# EAGLE schematic iomodul2 (EAGLE 6.6.0)
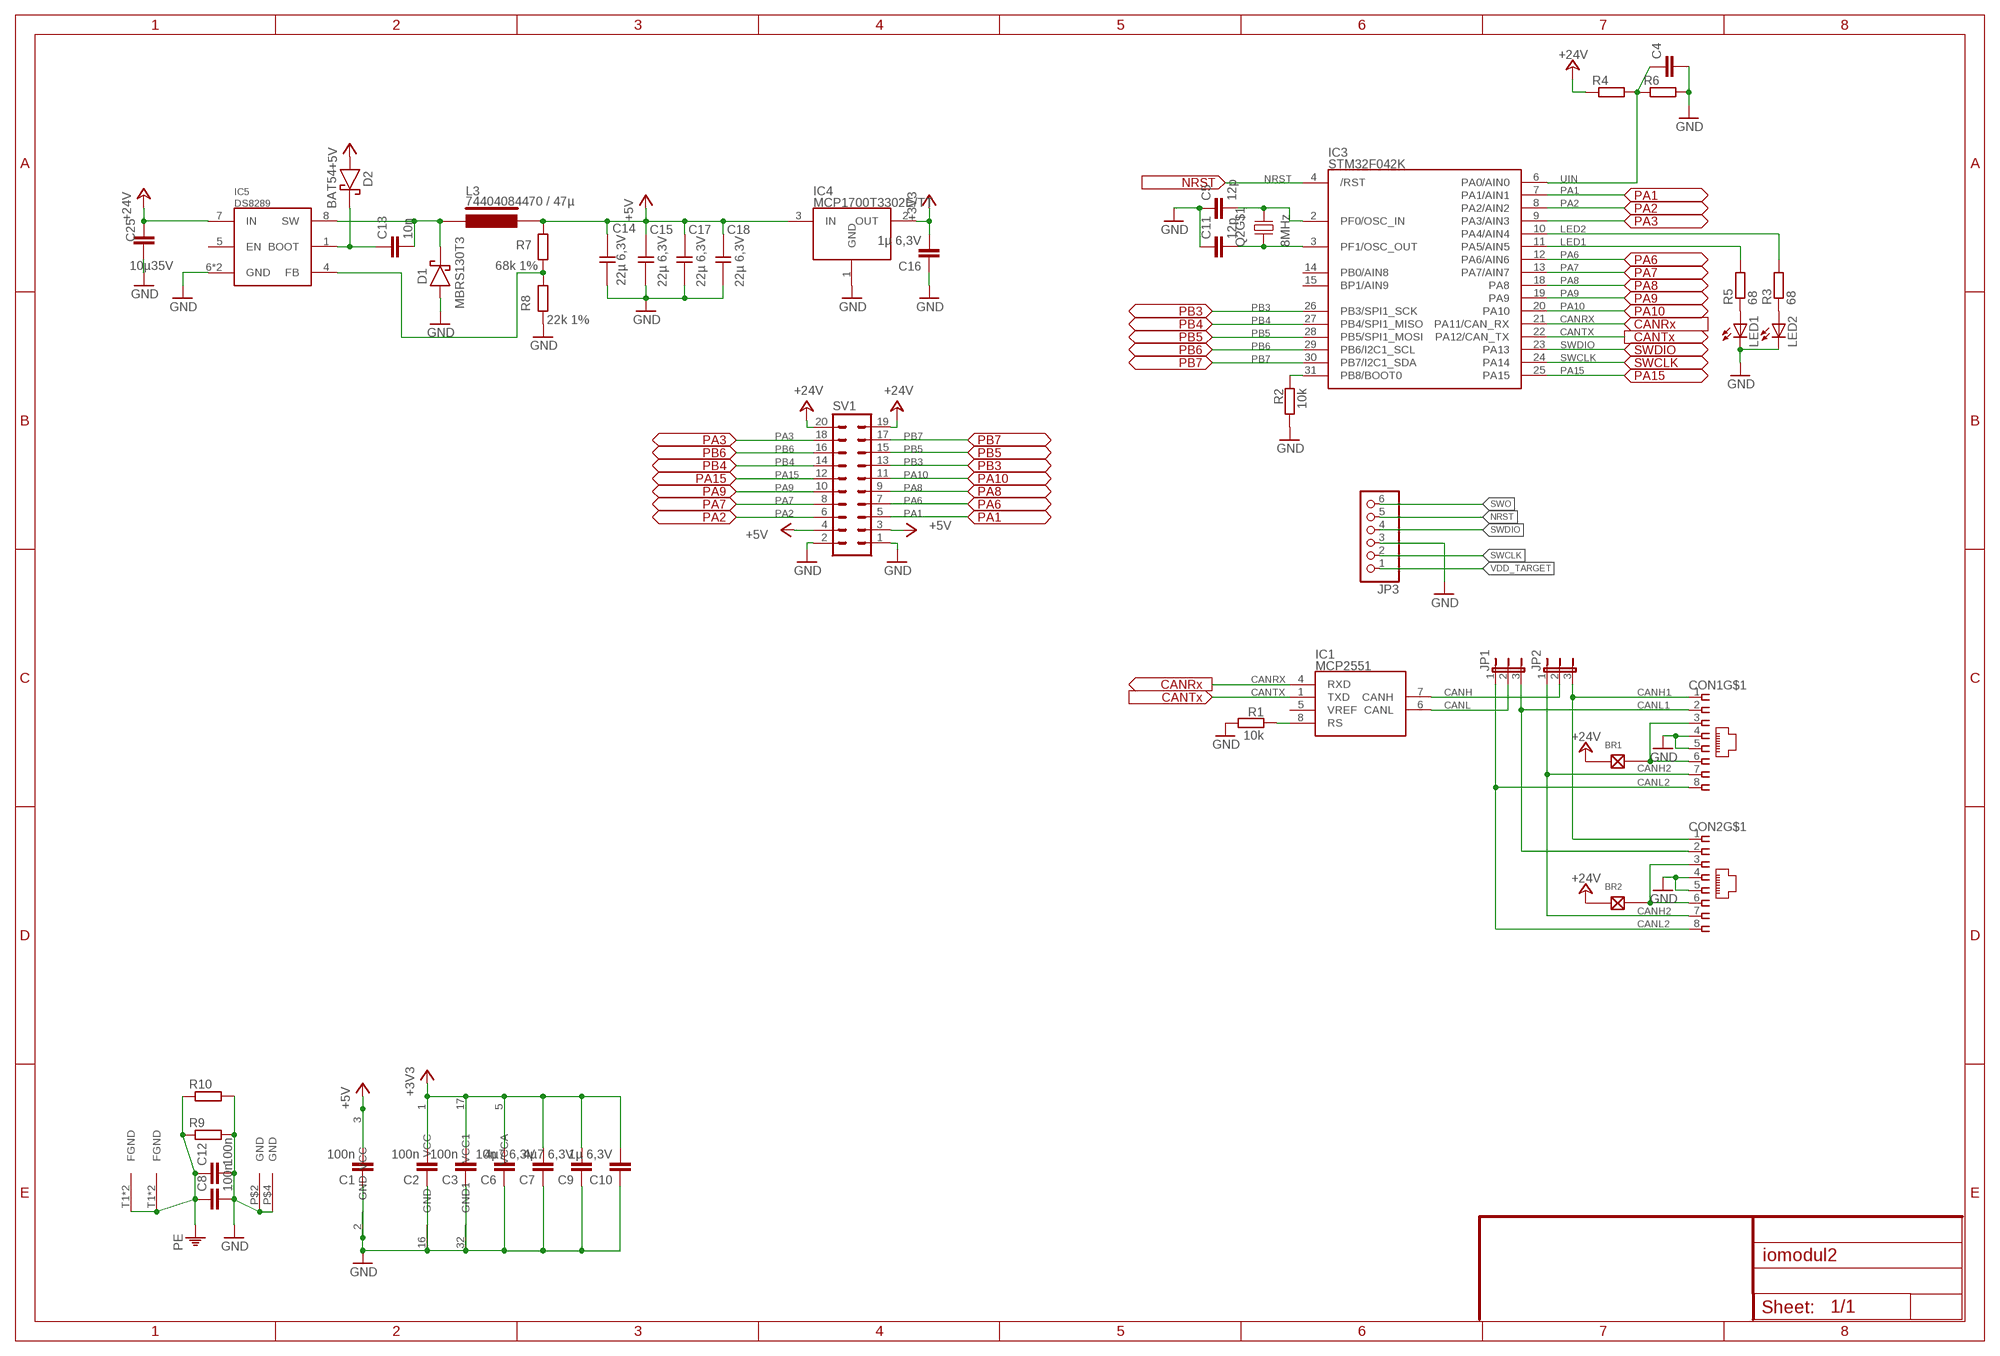
[diagram p0: schematic, sheet 1]

## Parts
BR1  LÖTBRÜCKE-S  [LÖTBRÜCKE]
BR2  LÖTBRÜCKE-S  [LÖTBRÜCKE]
C1  100n  C-EUC1206  [C1206]
C2  100n  C-EUC1206  [C1206]
C3  100n  C-EUC1206  [C1206]
C4  C-EUC1206  [C1206]
C5  12p  C-EUC1206  [C1206]
C6  10n  C-EUC1206  [C1206]
C7  4µ7 6,3V  C-EUC1206  [C1206]
C8  100n  C-EUC1206  [C1206]
C9  4µ7 6,3V  C-EUC1206  [C1206]
C10  1µ 6,3V  C-EUC1206  [C1206]
C11  12p  C-EUC1206  [C1206]
C12  100n  C-EUC1206  [C1206]
C13  10n  C-EUC1206  [C1206]
C14  22µ 6,3V  CAP1210  [1210]
C15  22µ 6,3V  CAP1210  [1210]
C16  1µ 6,3V  C-EUC1206  [C1206]
C17  22µ 6,3V  CAP1210  [1210]
C18  22µ 6,3V  CAP1210  [1210]
C25  10µ35V  C-EUC1206  [C1206]
CON1  MEBP_8-8G  [MEBP]
CON2  MEBP_8-8G  [MEBP]
D1  MBRS130T3  [SMB]
D2  BAT54  [SOT23/32]
IC1  MCP2551  [SO-8]
IC3  STM32F042K  STM32F042  [LQFP32]
IC4  MCP1700T3302E/TT  MCP1700  [SOT23]
IC5  DS8289  [SO8-POWERPAD]
JP1  JP2E  [JP2]
JP2  JP2E  [JP2]
JP3  PINHD-1X6  [1X06]
L3  74404084470 / 47µ  WE-LQS  [WE-LQS]
LED1  LEDCHIPLED_0603  [CHIPLED_0603]
LED2  LEDCHIPLED_0603  [CHIPLED_0603]
Q2  8MHz  MT-CRYSTAL  [MT-CRYSTAL]
R1  10k  R-EU_R1206  [R1206]
R2  10k  R-EU_R1206  [R1206]
R3  68  R-EU_R1206  [R1206]
R4  R-EU_R1206  [R1206]
R5  68  R-EU_R1206  [R1206]
R6  R-EU_R1206  [R1206]
R7  68k 1%  R-EU_R1206  [R1206]
R8  22k 1%  R-EU_R1206  [R1206]
R9  R-EU_R1206  [R1206]
R10  R-EU_R1206  [R1206]
SV1  MA10-2  [MA10-2]

## Nets
+3V3: C2.2 C3.2 C6.2 C7.2 C9.2 C10.2 C16.2 IC3.1(VCC) IC3.5(VCCA) IC3.17(VCC1) IC4.2(OUT)
+5V: C1.2 C14.2 C15.2 C17.2 C18.2 D2.1(A) IC1.3(VCC) IC4.3(IN) L3.P$2 R7.2 SV1.3 SV1.4
+24V: BR1.1 BR2.1 C25.2 IC5.7(IN) R4.1 SV1.19 SV1.20
CANH: IC1.7(CANH) JP2.2
CANH1: CON1.1 CON2.1 JP2.3
CANH2: CON1.7 CON2.7 JP2.1
CANL: IC1.6(CANL) JP1.2
CANL1: CON1.2 CON2.2 JP1.3
CANL2: CON1.8 CON2.8 JP1.1
CANRX: IC1.4(RXD) IC3.21(PA11/CAN_RX)
CANTX: IC1.1(TXD) IC3.22(PA12/CAN_TX)
GND: C1.1 C2.1 C3.1 C4.2 C5.1 C6.1 C7.1 C8.2 C9.1 C10.1 C11.1 C12.2 C14.1 C15.1 C16.1 C17.1 C18.1 C25.1 CON1.4 CON1.5 CON2.4 CON2.5 D1.A IC1.2(GND) IC3.16(GND) IC3.32(GND1) IC4.1(GND) IC5.6(GND) IC5.TP(GND) JP3.3 LED1.C LED2.C Q2.P$2(GND) Q2.P$4(GND) R1.2 R2.2 R6.2 R8.1 R9.2 R10.2 SV1.1 SV1.2
LED1: IC3.11(PA5/AIN5) R5.2
LED2: IC3.10(PA4/AIN4) R3.2
N$1: IC1.8(RS) R1.1
N$2: BR1.2 CON1.3 CON1.6
N$3: LED2.A R3.1
N$4: C11.2 IC3.3(PF1/OSC_OUT) Q2.P$1
N$5: C5.2 IC3.2(PF0/OSC_IN) Q2.P$3
N$6: BR2.2 CON2.3 CON2.6
N$7: LED1.A R5.1
N$12: C13.1 D2.3(K) IC5.1(BOOT)
N$13: C13.2 D1.K IC5.8(SW) L3.P$1
N$15: IC3.31(PB8/BOOT0) R2.1
N$18: IC5.4(FB) R7.1 R8.2
NRST: IC3.4(/RST) JP3.5
PA1: IC3.7(PA1/AIN1) SV1.5
PA2: IC3.8(PA2/AIN2) SV1.6
PA3: IC3.9(PA3/AIN3) SV1.18
PA6: IC3.12(PA6/AIN6) SV1.7
PA7: IC3.13(PA7/AIN7) SV1.8
PA8: IC3.18(PA8) SV1.9
PA9: IC3.19(PA9) SV1.10
PA10: IC3.20(PA10) SV1.11
PA15: IC3.25(PA15) SV1.12
PB3: IC3.26(PB3/SPI1_SCK) SV1.13
PB4: IC3.27(PB4/SPI1_MISO) SV1.14
PB5: IC3.28(PB5/SPI1_MOSI) SV1.15
PB6: IC3.29(PB6/I2C1_SCL) SV1.16
PB7: IC3.30(PB7/I2C1_SDA) SV1.17
PE: C8.1 C12.1 CON1.T1(FGND) CON1.T2(FGND) CON2.T1(FGND) CON2.T2(FGND) R9.1 R10.1
SWCLK: IC3.24(PA14) JP3.2
SWDIO: IC3.23(PA13) JP3.4
SWO: JP3.6
UIN: C4.1 IC3.6(PA0/AIN0) R4.2 R6.1
VDD_TARGET: JP3.1
Unconnected: IC1.5(VREF) IC3.14(PB0/AIN8) IC3.15(BP1/AIN9) IC5.5(EN)

## Library data of the parts
BR1 BR2 = myspecial:LÖTBRÜCKE
C1-C13 C16 C25 = schlager_passiv:C-EU: CAPACITOR, European symbol
C14 C15 C17 C18 = MYPASS:CAP1210
CON1 CON2 = myconn:MEBP_8-8G: Reichelt RJ45 geschirmt MEBP 8-8G
D1 = MYDISCR:MBRS130T3
D2 = MYDISCR:BAT54
IC1 = MYMCHIP:MCP2551: CAN Transceiver
IC3 = MYSGS:STM32F042
IC4 = MYMCHIP:MCP1700: LDO 250mA
IC5 = MYRichtek:DS8289
JP1 JP2 = jumper:JP2E: JUMPER
JP3 = pinhead:PINHD-1X6: PIN HEADER
L3 = myinductiv:WE-LQS
LED1 LED2 = led:LED: LED OSRAM: - CHIPLED LG R971, LG N971, LY N971, LG Q971, LY Q971, LO R971, LY R971 LH N974, LH R974 LS Q976, LO Q976, LY Q976 LO Q996 - Hyper CHIPLED LW Q18S LB Q993, LB Q99A, LB R99A - SideLED LS A670, LO A670, LY A670, LG A670, LP A670 LB A673, LV A673, LT A673, LW A673 LH A674 LY A675 LS A676, LA A676, LO A676, LY A676, LW A676 LS A679, LY A679, LG A679 - Hyper Micro SIDELED® LS Y876, LA Y876, LO Y876, LY Y876 LT Y87S - SmartLED LW L88C, LW L88S LB L89C, LB L89S, LG L890 LS L89K, LO L89K, LY L89K LS L896, LA L896, LO L896, LY L896 - TOPLED LS T670, LO T670, LY T670, LG T670, LP T670 LSG T670, LSP T670, LSY T670, LOP T670, LYG T670 LG T671, LOG T671, LSG T671 LB T673, LV T673, LT T673, LW T673 LH T674 LS T676, LA T676, LO T676, LY T676, LB T676, LH T676, LSB T676, LW T676 LB T67C, LV T67C, LT T67C, LS T67K, LO T67K, LY T67K, LW E67C LS E67B, LA E67B, LO E67B, LY E67B, LB E67C, LV E67C, LT E67C LW T67C LS T679, LY T679, LG T679 LS T770, LO T770, LY T770, LG T770, LP T770 LB T773, LV T773, LT T773, LW T773 LH T774 LS E675, LA E675, LY E675, LS T675 LS T776, LA T776, LO T776, LY T776, LB T776 LHGB T686 LT T68C, LB T68C - Hyper Mini TOPLED® LB M676 - Mini TOPLED Santana® LG M470 LS M47K, LO M47K, LY M47K Source: http://www.osram.convergy.de LUXEON: - LUMILED® LXK2-PW12-R00, LXK2-PW12-S00, LXK2-PW14-U00, LXK2-PW14-V00 LXK2-PM12-R00, LXK2-PM12-S00, LXK2-PM14-U00 LXK2-PE12-Q00, LXK2-PE12-R00, LXK2-PE12-S00, LXK2-PE14-T00, LXK2-PE14-U00 LXK2-PB12-K00, LXK2-PB12-L00, LXK2-PB12-M00, LXK2-PB14-N00, LXK2-PB14-P00, LXK2-PB14-Q00 LXK2-PR12-L00, LXK2-PR12-M00, LXK2-PR14-Q00, LXK2-PR14-R00 LXK2-PD12-Q00, LXK2-PD12-R00, LXK2-PD12-S00 LXK2-PH12-R00, LXK2-PH12-S00 LXK2-PL12-P00, LXK2-PL12-Q00, LXK2-PL12-R00 Source: www.luxeon.com KINGBRIGHT: KA-3528ASYC Source: www.kingbright.com
Q2 = MYPASS:MT-CRYSTAL: 3,2 x 2,5mm Reichelt
R1-R10 = schlager_passiv:R-EU_: RESISTOR, European symbol
SV1 = con-lstb:MA10-2: PIN HEADER; OC_FARNELL: unknown; OC_NEWARK: unknown